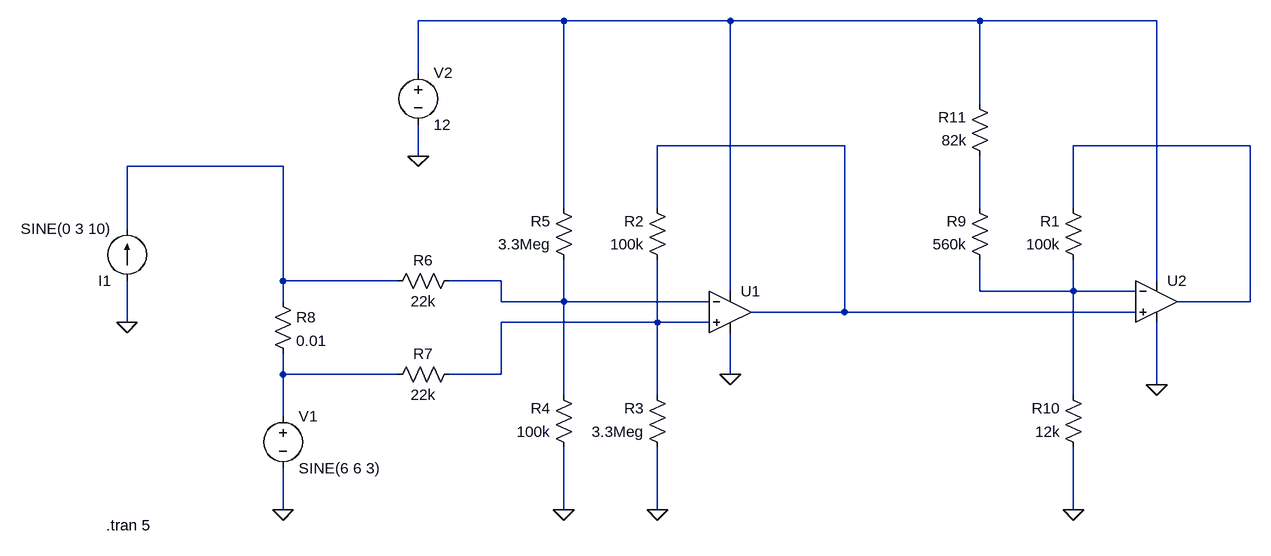
[diagram p0: schematic I_sense_hi_V_concept_01.asc]
I_sense_hi_V_concept_01.asc, the LTspice schematic file:
Version 4
SHEET 1 1060 680
WIRE 0 -272 -224 -272
WIRE 256 -272 0 -272
WIRE 640 -272 256 -272
WIRE 912 -272 640 -272
WIRE -224 -192 -224 -272
WIRE 640 -144 640 -272
WIRE 432 -80 144 -80
WIRE 1056 -80 784 -80
WIRE -224 -64 -224 -112
WIRE -432 -48 -672 -48
WIRE 0 16 0 -272
WIRE 144 16 144 -80
WIRE 640 16 640 -64
WIRE 784 16 784 -80
WIRE -672 48 -672 -48
WIRE -432 128 -432 -48
WIRE -256 128 -432 128
WIRE -96 128 -176 128
WIRE 912 128 912 -272
WIRE 256 144 256 -272
WIRE 640 144 640 96
WIRE 784 144 784 96
WIRE 784 144 640 144
WIRE 880 144 784 144
WIRE -432 160 -432 128
WIRE -96 160 -96 128
WIRE 0 160 0 96
WIRE 0 160 -96 160
WIRE 224 160 0 160
WIRE 1056 160 1056 -80
WIRE 1056 160 944 160
WIRE 432 176 432 -80
WIRE 432 176 288 176
WIRE 880 176 432 176
WIRE -672 192 -672 128
WIRE 144 192 144 96
WIRE 144 192 -96 192
WIRE 224 192 144 192
WIRE -432 272 -432 240
WIRE -256 272 -432 272
WIRE -96 272 -96 192
WIRE -96 272 -176 272
WIRE 256 272 256 208
WIRE 912 288 912 192
WIRE 0 304 0 160
WIRE 144 304 144 192
WIRE 784 304 784 144
WIRE -432 336 -432 272
WIRE -432 480 -432 416
WIRE 0 480 0 384
WIRE 144 480 144 384
WIRE 784 480 784 384
FLAG -432 480 0
FLAG 0 480 0
FLAG 144 480 0
FLAG 256 272 0
FLAG -224 -64 0
FLAG -672 192 0
FLAG 912 288 0
FLAG 784 480 0
SYMBOL OpAmps\\UniversalOpAmp 256 176 R0
SYMATTR InstName U1
SYMBOL res 160 112 R180
WINDOW 0 36 76 Left 2
WINDOW 3 36 40 Left 2
SYMATTR InstName R2
SYMATTR Value 100k
SYMBOL res 160 400 R180
WINDOW 0 36 76 Left 2
WINDOW 3 36 40 Left 2
SYMATTR InstName R3
SYMATTR Value 3.3Meg
SYMBOL res 16 400 R180
WINDOW 0 36 76 Left 2
WINDOW 3 36 40 Left 2
SYMATTR InstName R4
SYMATTR Value 100k
SYMBOL res 16 112 R180
WINDOW 0 36 76 Left 2
WINDOW 3 36 40 Left 2
SYMATTR InstName R5
SYMATTR Value 3.3Meg
SYMBOL res -272 144 R270
WINDOW 0 32 56 VTop 2
WINDOW 3 0 56 VBottom 2
SYMATTR InstName R6
SYMATTR Value 22k
SYMBOL res -272 288 R270
WINDOW 0 32 56 VTop 2
WINDOW 3 0 56 VBottom 2
SYMATTR InstName R7
SYMATTR Value 22k
SYMBOL res -448 144 R0
SYMATTR InstName R8
SYMATTR Value 0.01
SYMBOL voltage -432 320 R0
WINDOW 123 0 0 Left 0
WINDOW 39 0 0 Left 0
SYMATTR InstName V1
SYMATTR Value SINE(6 6 3)
SYMBOL voltage -224 -208 R0
WINDOW 123 0 0 Left 0
WINDOW 39 0 0 Left 0
SYMATTR InstName V2
SYMATTR Value 12
SYMBOL current -672 128 R180
WINDOW 123 0 0 Left 0
WINDOW 39 0 0 Left 0
SYMATTR InstName I1
SYMATTR Value SINE(0 3 10)
SYMBOL OpAmps\\UniversalOpAmp 912 160 R0
SYMATTR InstName U2
SYMBOL res 800 112 R180
WINDOW 0 36 76 Left 2
WINDOW 3 36 40 Left 2
SYMATTR InstName R1
SYMATTR Value 100k
SYMBOL res 656 112 R180
WINDOW 0 36 76 Left 2
WINDOW 3 36 40 Left 2
SYMATTR InstName R9
SYMATTR Value 560k
SYMBOL res 800 400 R180
WINDOW 0 36 76 Left 2
WINDOW 3 36 40 Left 2
SYMATTR InstName R10
SYMATTR Value 12k
SYMBOL res 656 -48 R180
WINDOW 0 36 76 Left 2
WINDOW 3 36 40 Left 2
SYMATTR InstName R11
SYMATTR Value 82k
TEXT -704 504 Left 2 !.tran 5

The netlist it stands for:
* I_sense_hi_V_concept_01.asc
XU1 N008 N006 N001 0 N002 level1 Avol=1Meg GBW=10Meg Vos=0 En=0 Enk=0 In=0 Ink=0 Rin=500Meg  ; pins In+ In- V+ V- OUT
R2 N008 N002 100k
R3 0 N008 3.3Meg
R4 0 N006 100k
R5 N006 N001 3.3Meg
R6 N004 N006 22k
R7 N009 N008 22k
R8 N004 N009 0.01
V1 N009 0 SINE(6 6 3)
V2 N001 0 12
I1 0 N004 SINE(0 3 10)
XU2 N002 N007 N001 0 N003 level1 Avol=1Meg GBW=10Meg Vos=0 En=0 Enk=0 In=0 Ink=0 Rin=500Meg  ; pins In+ In- V+ V- OUT
R1 N007 N003 100k
R9 N007 N005 560k
R10 0 N007 12k
R11 N005 N001 82k
.tran 5
.lib UniversalOpAmp1.lib
.backanno
.end